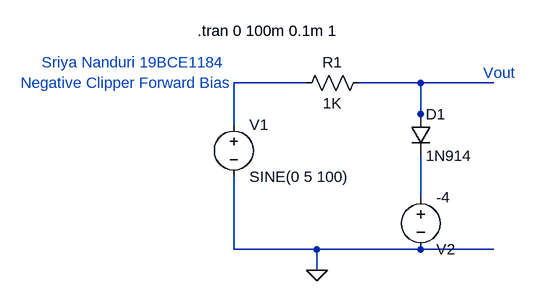
[diagram p0: schematic negative clipper forward bias (1).asc]
negative clipper forward bias (1).asc, the LTspice schematic file:
Version 4
SHEET 1 880 680
WIRE 208 48 96 48
WIRE 384 48 288 48
WIRE 496 48 384 48
WIRE 384 96 384 48
WIRE 96 112 96 48
WIRE 384 112 384 96
WIRE 384 224 384 160
WIRE 96 304 96 192
WIRE 224 304 96 304
WIRE 384 304 224 304
WIRE 496 304 384 304
WIRE 224 336 224 304
FLAG 224 336 0
SYMBOL voltage 96 96 R0
WINDOW 123 0 0 Left 0
WINDOW 39 0 0 Left 0
SYMATTR InstName V1
SYMATTR Value SINE(0 5 100)
SYMBOL res 304 32 R90
WINDOW 0 0 56 VBottom 2
WINDOW 3 32 56 VTop 2
SYMATTR InstName R1
SYMATTR Value 1K
SYMBOL diode 368 96 R0
SYMATTR InstName D1
SYMATTR Value 1N914
SYMBOL voltage 384 208 R0
WINDOW 0 24 96 Left 2
WINDOW 3 24 16 Left 2
WINDOW 123 0 0 Left 0
WINDOW 39 0 0 Left 0
SYMATTR InstName V2
SYMATTR Value -4
TEXT 480 32 Left 2 ;Vout
TEXT 40 -32 Left 2 !.tran 0 100m 0.1m 1
TEXT -200 16 Left 2 ;Sriya Nanduri 19BCE1184
TEXT -232 48 Left 2 ;Negative Clipper Forward Bias

The netlist it stands for:
* negative clipper forward bias (1).asc
V1 N001 0 SINE(0 5 100)
R1 N002 N001 1K
D1 N002 N003 1N914
V2 N003 0 -4
.model D D
.lib standard.dio
* Vout
.tran 0 100m 0.1m 1
* Sriya Nanduri 19BCE1184
* Negative Clipper Forward Bias
.backanno
.end